# EAGLE design AntennaPCB (EAGLE 9.1.3)
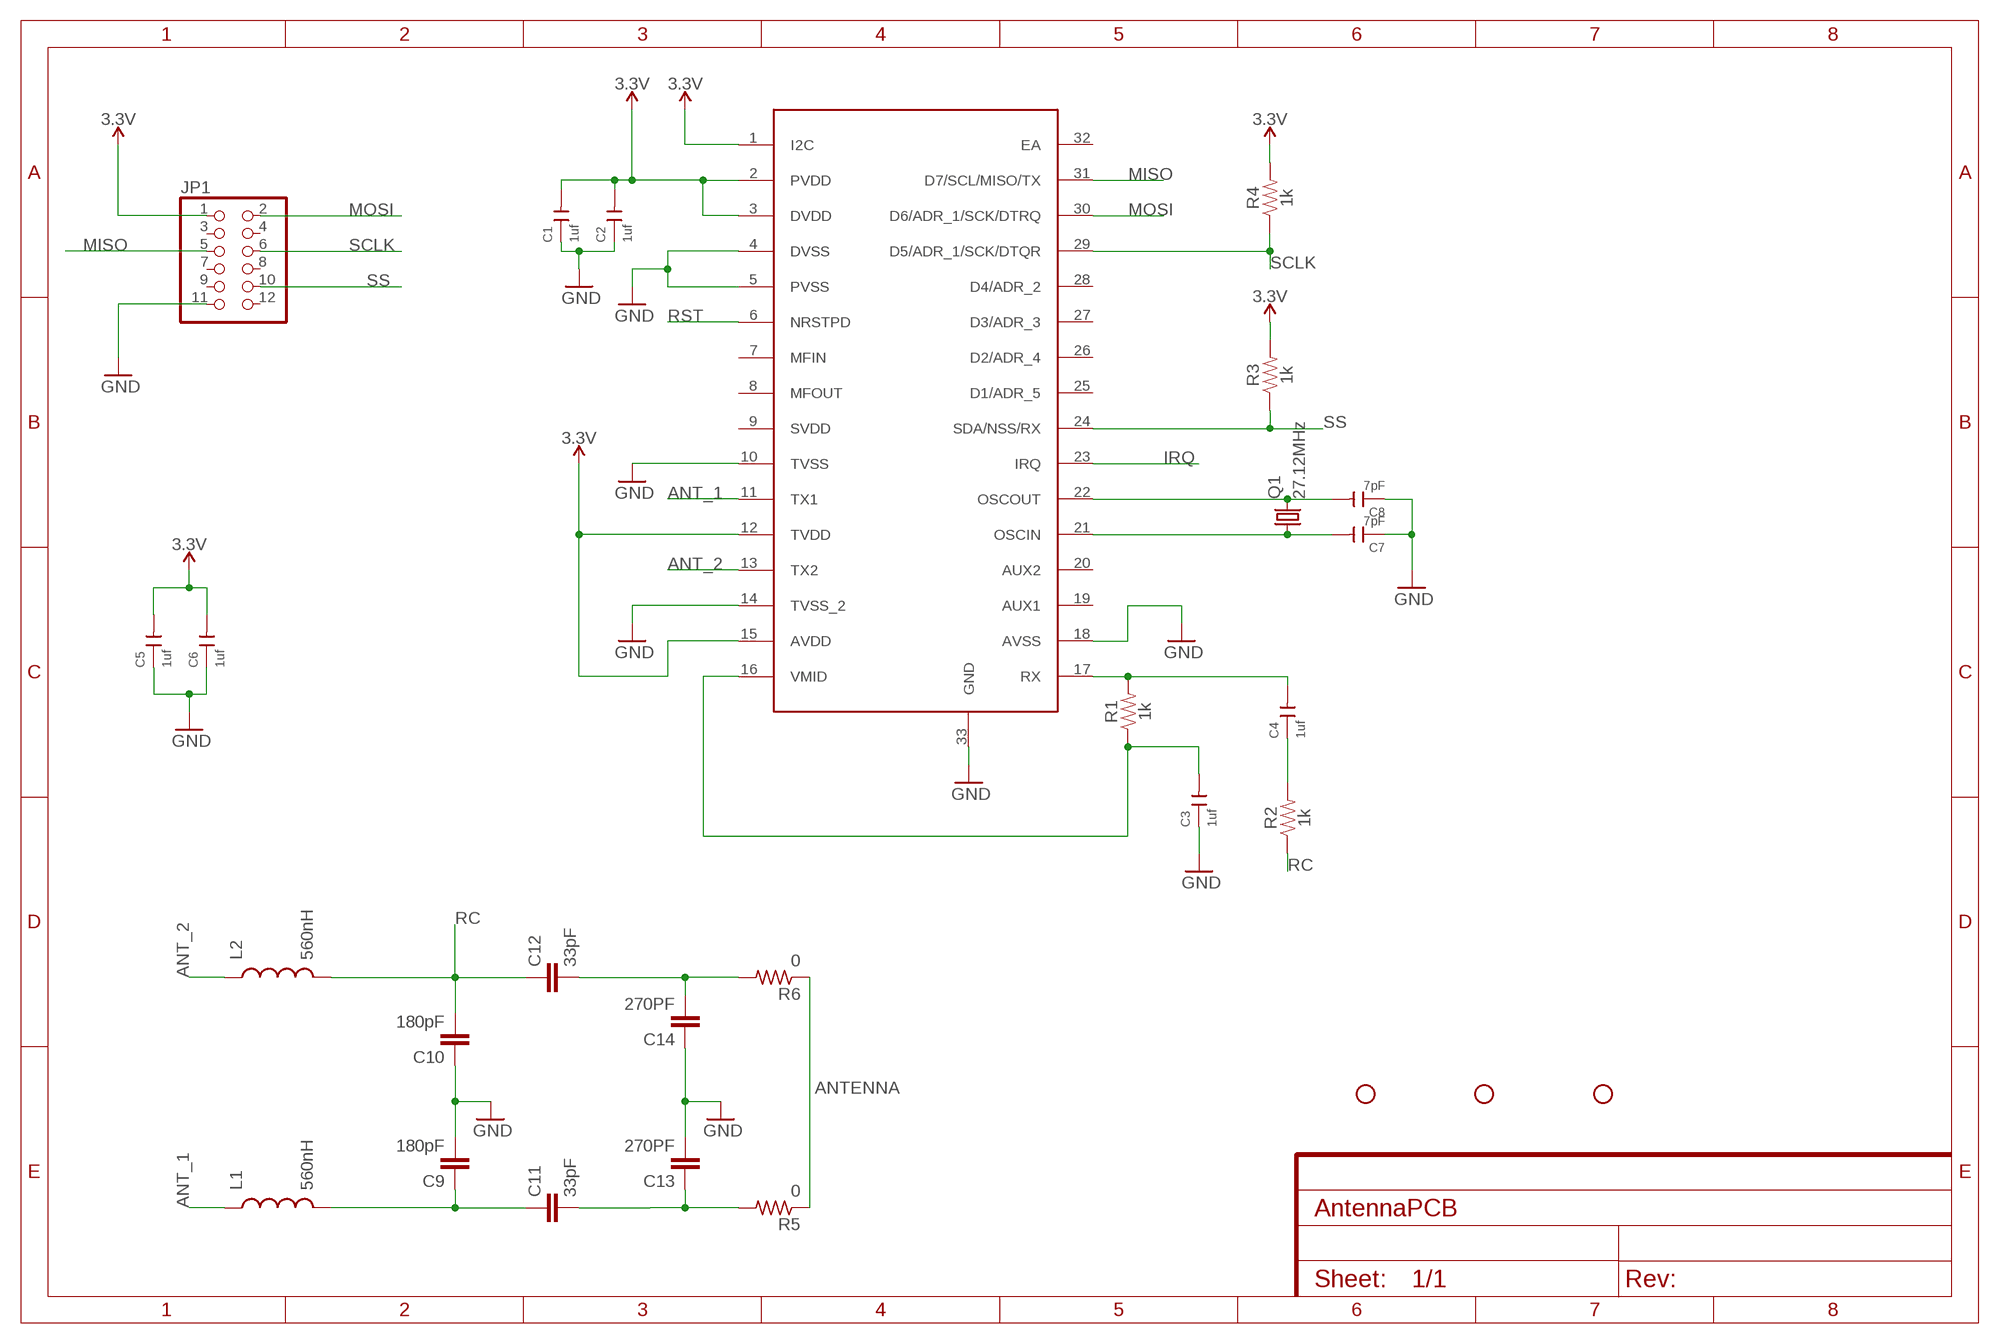
[diagram p0: schematic, sheet 1]
FRAME1 (FRAME-A4L): SPICEPREFIX: X

## Parts
C1  1uf  CERAMIC-1UF-25V-10%-X7R(0603)  [C0603]
C2  1uf  CERAMIC-1UF-25V-10%-X7R(0603)  [C0603]
C3  1uf  CERAMIC-1UF-25V-10%-X7R(0603)  [C0603]
C4  1uf  CERAMIC-1UF-25V-10%-X7R(0603)  [C0603]
C5  1uf  CERAMIC-1UF-25V-10%-X7R(0603)  [C0603]
C6  1uf  CERAMIC-1UF-25V-10%-X7R(0603)  [C0603]
C7  7pF  CERAMIC-1UF-25V-10%-X7R(0603)  [C0603]
C8  7pF  CERAMIC-1UF-25V-10%-X7R(0603)  [C0603]
C9  180pF  180PF-0603-50V-5%  [0603]
C10  180pF  180PF-0603-50V-5%  [0603]
C11  33pF  33PF-0603-50V-5%  [0603]
C12  33pF  33PF-0603-50V-5%  [0603]
C13  270PF  270PF-0603-50V-5%  [0603]
C14  270PF  270PF-0603-50V-5%  [0603]
H1  STAND-OFF  [STAND-OFF]
H2  STAND-OFF  [STAND-OFF]
H3  STAND-OFF  [STAND-OFF]
JP1  PINHD-2X6  [2X06]
L1  560nH  INDUCTOR  [L0603]
L2  560nH  INDUCTOR  [L0603]
Q1  27.12MHz  CRYSTALHC49S  [HC49/S]
R1  1k  1KOHM-0603-1/10W-1%  [0603]
R2  1k  1KOHM-0603-1/10W-1%  [0603]
R3  1k  1KOHM-0603-1/10W-1%  [0603]
R4  1k  1KOHM-0603-1/10W-1%  [0603]
R5  0  ERJ-8GEY0R00V  [RES_1206]
R6  0  ERJ-8GEY0R00V  [RES_1206]
U$1  MFRC522  [HVQFN32]

## Nets
3.3V: C1.2 C2.2 C5.2 C6.2 JP1.1 R3.2 R4.2 U$1.1(I2C) U$1.2(PVDD) U$1.3(DVDD) U$1.12(TVDD) U$1.15(AVDD)
ANT_1: L1.1 U$1.11(TX1)
ANT_2: L2.1 U$1.13(TX2)
ANTENNA: R5.1 R6.1
GND: C1.1 C2.1 C3.1 C5.1 C6.1 C7.1 C8.1 C9.2 C10.1 C13.2 C14.1 JP1.11 U$1.4(DVSS) U$1.5(PVSS) U$1.10(TVSS) U$1.14(TVSS_2) U$1.18(AVSS) U$1.33(GND)
IRQ: U$1.23(IRQ)
MISO: JP1.5 U$1.31(D7/SCL/MISO/TX)
MOSI: JP1.2 U$1.30(D6/ADR_1/SCK/DTRQ)
N$1: C3.2 R1.1 U$1.16(VMID)
N$2: C4.2 R1.2 U$1.17(RX)
N$3: C4.1 R2.2
N$5: C8.2 Q1.2 U$1.22(OSCOUT)
N$6: C7.2 Q1.1 U$1.21(OSCIN)
N$9: C9.1 C11.1 L1.2
N$10: C11.2 C13.1 R5.2
N$11: C12.2 C14.2 R6.2
RC: C10.2 C12.1 L2.2 R2.1
RST: U$1.6(NRSTPD)
SCLK: JP1.6 R4.1 U$1.29(D5/ADR_1/SCK/DTQR)
SS: JP1.10 R3.1 U$1.24(SDA/NSS/RX)
Unconnected: JP1.3 JP1.4 JP1.7 JP1.8 JP1.9 JP1.12 U$1.7(MFIN) U$1.8(MFOUT) U$1.9(SVDD) U$1.19(AUX1) U$1.20(AUX2) U$1.25(D1/ADR_5) U$1.26(D2/ADR_4) U$1.27(D3/ADR_3) U$1.28(D4/ADR_2) U$1.32(EA)

## Library data of the parts
C1-C6 = Seeed-Capacitor:CERAMIC-1UF-25V-10%-X7R(0603): 302010139; MPN: CC0603KRX7R8BB105
C7 C8 = Seeed-Capacitor:CERAMIC-1UF-25V-10%-X7R(0603): 302010139; MPN: CC0603KRX7R8BB105; VALUE: 1uf
C9 C10 = SparkFun-Capacitors:180PF: 180pF/0.18nF ceramic capacitors A capacitor is a passive two-terminal electrical component used to store electrical energy temporarily in an electric field.; PROD_ID: CAP-11661
C11 C12 = SparkFun-Capacitors:33PF: 33pF ceramic capacitors A capacitor is a passive two-terminal electrical component used to store electrical energy temporarily in an electric field.; PROD_ID: CAP-10142
C13 C14 = SparkFun-Capacitors:270PF: 270pF/0.27nF ceramic capacitors A capacitor is a passive two-terminal electrical component used to store electrical energy temporarily in an electric field.; PROD_ID: CAP-13339
H1-H3 = SparkFun-Hardware:STAND-OFF: Stand Off Drill holes for mechanically mounting via screws, standoffs, etc. Note: Use the keepout ring to avoid running the screw head into surrounding components. Variant Overviews STAND-OFF - Mechanical footprint for a #4 phillips button head screw. STAND-OFF-TIGHT - Mechanical footprint for a #4 phillips button head screw, Example SparkFun Products Screw - Phillips Head (1/4", 4-40, 10 pack) <https://www.sparkfun.com/products/10453> (PRT-10453) Screw - Phillips Head (1/2", 4-40, 10 pack) <https://www.sparkfun.com/products/10452> (PRT-10452) Screw - Phillips Head (3/4", 4-40, 10 pack) <https://www.sparkfun.com/products/10451> (PRT-10451) Screw - Phillips Head (1", 4-40, 10 pack) <https://www.sparkfun.com/products/10450> (PRT-10450)
JP1 = pinhead:PINHD-2X6: PIN HEADER
L1 L2 = BeagleBone_Blue_R3:INDUCTOR: Inductors Basic Inductor/Choke - 0603 and 1206. Footprints are not proven and vary greatly between part numbers. SRN6045- 33uH, 20% 1.4A
Q1 = crystal:CRYSTAL: CRYSTAL; OC_FARNELL: 1667008; OC_NEWARK: unknown
R1-R4 = SparkFun-Resistors:1KOHM: 1kΩ resistor A resistor is a passive two-terminal electrical component that implements electrical resistance as a circuit element. Resistors act to reduce current flow, and, at the same time, act to lower voltage levels within circuits. - Wikipedia; PROD_ID: RES-07856
R5 R6 = Resistor_Capacitor:ERJ-8GEY0R00V: RES SMD 0 OHM JUMPER 1/4W 1206 Manufacturer's datasheet <https://industrial.panasonic.com/ww/products/resistors/chip-resistors/general-purpose-chip-resistors/thick-film-chip-resistors/ERJ8GEY0R00V>; CREATED_BY: PCBLayout.com; DIGIKEY_PART_NUMBER: P0.0ETR-ND; MANUFACTURER: Panasonic Electronic Components; MPN: ERJ-8GEY0R00V; PACKAGE: SMD 1206
U$1 = SeniorDesignParts:MFRC522

## Board
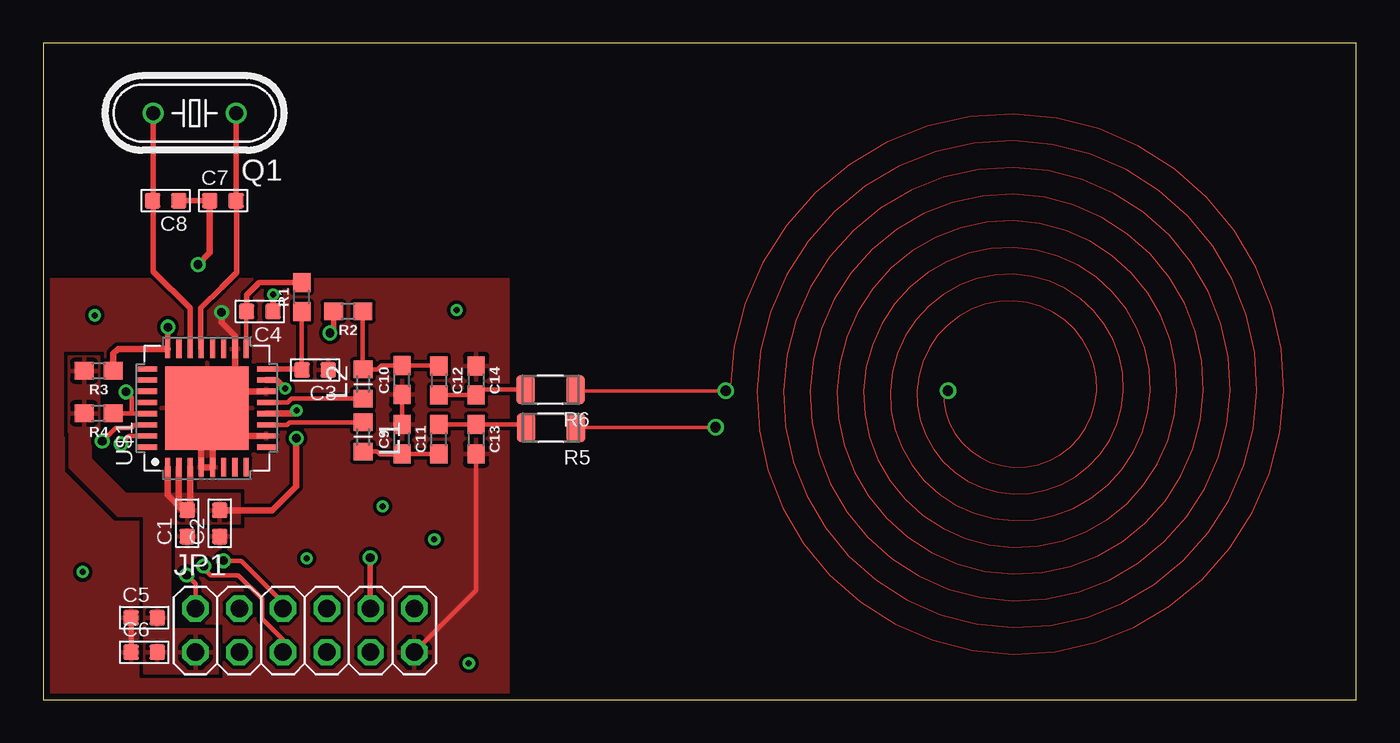
[diagram p1: board, top side]
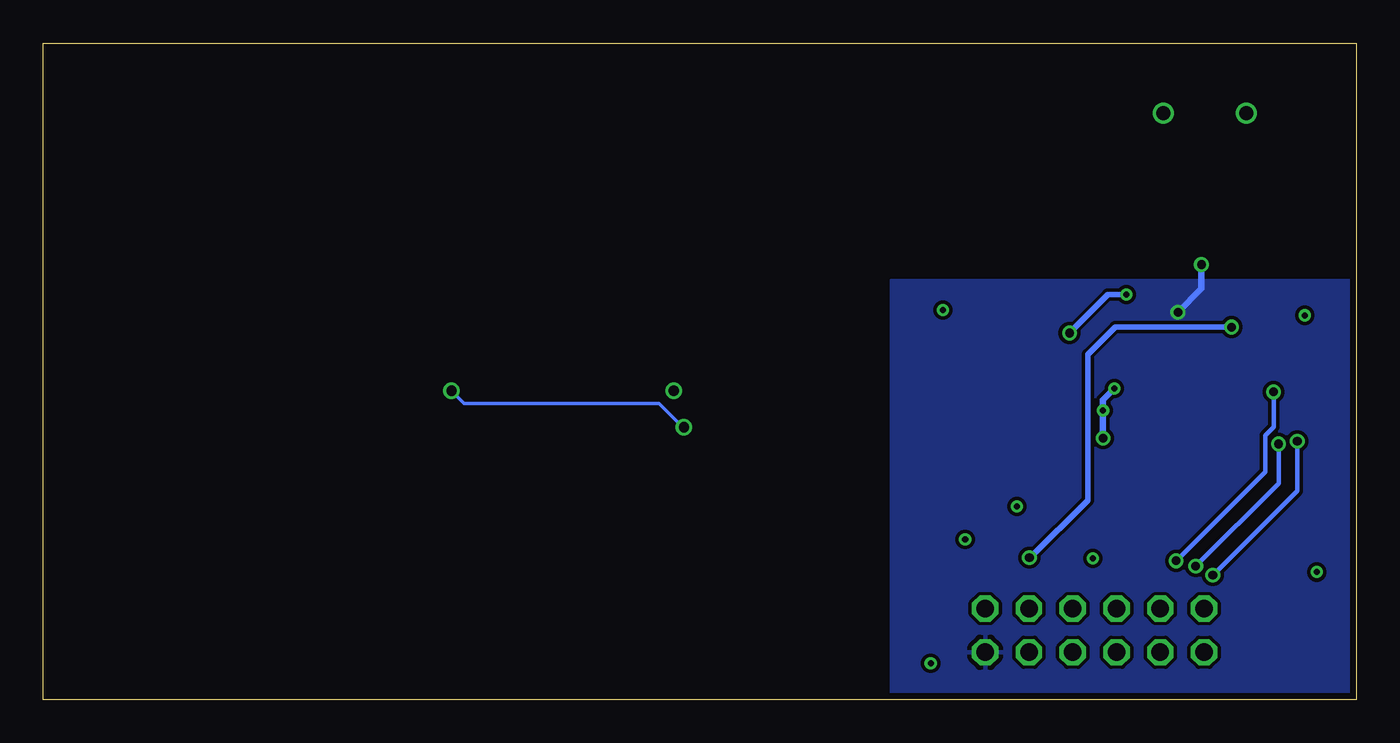
[diagram p2: board, bottom side, seen from below]

Size 76.2 x 38.1 mm. Coordinates in mm from the lower left corner, seen from the top.
Outline: 0,0 76.2,0 76.2,38.1 0,38.1 0,0
Copper layers (1*16): Top 0.0356mm / dielectric 1.5011mm / Bottom 0.0356mm
Design rules "ECE_Senior_Design": minimum track width 8mil, minimum drill 13mil, track to track 8mil, track to pad 8mil, pad to pad 6mil, via to via 8mil, smd to smd 6mil, copper to edge 15mil, drill to drill 8mil, minimum pad ring 7mil, minimum via ring 7mil, stop-mask expansion 3mil, vias tented up to drill 0mil, thermal gap 10mil

### Footprints (pad centres in the part's own frame; a part is rotated, then mirrored left to right if it is on the bottom)
C0603 = smd 0.889 x 0.889: 1 0,0.762; 2 0,-0.762
0603 = smd 1.1 x 1: 1 -0.85,0; 2 0.85,0
2X06 = drill 1.016 octagon: 1 -6.35,-1.27; 2 -6.35,1.27; 3 -3.81,-1.27; 4 -3.81,1.27; 5 -1.27,-1.27; 6 -1.27,1.27; 7 1.27,-1.27; 8 1.27,1.27; 9 3.81,-1.27; 10 3.81,1.27; 11 6.35,-1.27; 12 6.35,1.27
L0603 = smd 1 x 1.1: 1 -0.85,0; 2 0.85,0
HC49/S = drill 0.813: 1 -2.413,0; 2 2.413,0
RES_1206 = smd 1.08 x 1.68: 1 -1.445,0; 2 1.445,0
HVQFN32 = smd 1.075 x 0.3: 1 -0.263,5.45; 2 -0.263,4.8; 3 -0.263,4.15; 4 -0.263,3.5; 5 -0.263,2.85; 6 -0.263,2.2; 7 -0.263,1.55; 8 -0.263,0.9; 17 6.612,0.9; 18 6.612,1.55; 19 6.612,2.2; 20 6.612,2.85; 21 6.612,3.5; 22 6.612,4.15; 23 6.612,4.8; 24 6.612,5.45 | smd 0.3 x 1.075: 9 0.9,-0.263; 10 1.55,-0.263; 11 2.2,-0.263; 12 2.85,-0.263; 13 3.5,-0.263; 14 4.15,-0.263; 15 4.8,-0.263; 16 5.45,-0.263; 25 5.45,6.612; 26 4.8,6.612; 27 4.15,6.612; 28 3.5,6.612; 29 2.85,6.612; 30 2.2,6.612; 31 1.55,6.612; 32 0.9,6.612 | smd 4.85 x 4.85: 33 3.175,3.175

### Placement (x,y rotation side)
C1  8.37,10.23 180 top
C2  10.26,10.23 180 top
C3  15.78,19.13 270 top
C4  12.57,22.53 270 top
C5  5.87,4.75 90 top
C6  5.87,2.74 90 top
C7  10.44,28.96 90 top
C8  7.11,28.96 270 top
C9  20.83,15.11 90 top
C10  20.83,18.54 90 top
C11  22.96,15.11 90 top
C12  22.96,18.52 270 top
C13  25.12,15.11 270 top
C14  25.12,18.52 270 top
JP1  15.19,4.01 0 top
L1  18.57,15.24 270 top
L2  18.57,18.31 90 top
Q1  8.79,34.04 180 top
R1  15.01,23.36 90 top
R2  17.7,22.53 180 top
R3  3.23,19.08 180 top
R4  3.23,16.61 180 top
R5  29.46,15.77 180 top
R6  29.44,17.98 180 top
U$1  12.68,13.74 90 top

### Tracks (layer width: path | path; a pad name or v marks a point on that pad's centre or on a via)
3.3V  (via drill 0.35, 0.5)
  Top 0.381: U$1.1 7.23,11.87 8.11,10.99 C1.2 | U$1.2 7.88,11.48 C1.2 | U$1.3 8.53,11.15 C1.2 | C2.2 13.3,10.99 14.69,12.38 v14.69,15.16 v14.7,15.17 | v14.04,18.05 13.55,18.54 U$1.15 | U$1.12 14.08,16.59 14.1,16.61 14.54,16.61 v14.7,16.77
  Bottom 0.381: v14.7,15.17 v14.7,16.77 14.7,17.39 v14.04,18.05
  pour Top: 10.16,4.06 7.39,4.06 7.39,11.94 5.84,11.94 5.84,1.52 10.16,1.52
  pour Top: 7.11,10.92 7.11,10.21 11.43,10.21 11.43,11.94 11.18,11.94 7.11,11.94
  pour Top: 2.16,19.94 3.25,19.94 3.25,15.49 1.5,15.49 1.5,19.94
  pour Top: 1.52,17.27 1.52,13.46 4.32,10.67 7.62,10.67 7.62,11.94 4.83,11.94 2.79,13.97 2.79,17.27
ANT_1
  Top 0.254: U$1.11 14.16,15.94 14.31,16.09 L1.1
ANT_2
  Top 0.254: L2.1 14.41,17.46 14.19,17.24 U$1.13
ANTENNA  (via drill 0.6 pad 0.5)
  Top 0.01: v52.5,17.92 52.26,17.92 52.27,17.28 52.38,16.64 52.59,16.03 52.91,15.45 53.31,14.92 53.79,14.46 54.34,14.07 54.96,13.77 55.62,13.57 56.31,13.48 57.01,13.5 57.7,13.63 58.37,13.86 59.01,14.2 59.58,14.64 60.09,15.18 60.5,15.78 60.82,16.45 61.03,17.17 61.13,17.92 61.11,18.68 60.97,19.43 60.71,20.16 60.34,20.85 59.86,21.47 59.28,22.01 58.62,22.46 57.89,22.8 57.12,23.03 56.31,23.13 55.48,23.11 54.67,22.95 53.89,22.67 53.15,22.26 52.48,21.74 51.9,21.12 51.42,20.41 51.05,19.63 50.81,18.79 50.71,17.92 50.74,17.04 50.91,16.16 51.21,15.32 51.65,14.54 52.21,13.82 52.88,13.2 53.64,12.69 54.48,12.3 55.38,12.04 56.31,11.93 57.25,11.97 58.18,12.15 59.08,12.48 59.92,12.95 60.68,13.55 61.34,14.26 61.88,15.08 62.3,15.97 62.56,16.93 62.68,17.92 62.64,18.92 62.44,19.91 62.09,20.87 61.59,21.76 60.95,22.57 60.19,23.27 59.32,23.84 58.37,24.28 57.36,24.56 56.31,24.68 55.24,24.64 54.19,24.43 53.18,24.05 52.24,23.52 51.39,22.84 50.65,22.03 50.04,21.11 49.58,20.11 49.28,19.03 49.16,17.92 49.21,16.8 49.43,15.69 49.83,14.62 50.4,13.63 51.11,12.73 51.97,11.95 52.94,11.31 54,10.82 55.13,10.51 56.31,10.38 57.49,10.44 58.66,10.68 59.78,11.1 60.83,11.7 61.77,12.45 62.59,13.35 63.26,14.38 63.77,15.49 64.1,16.69 64.23,17.92 64.17,19.17 63.92,20.39 63.47,21.57 62.84,22.67 62.05,23.66 61.1,24.52 60.03,25.22 58.85,25.75 57.6,26.09 56.31,26.23 55,26.17 53.71,25.9 52.48,25.43 51.33,24.77 50.29,23.93 49.39,22.94 48.66,21.82 48.11,20.58 47.75,19.27 47.61,17.92 47.68,16.55 47.96,15.21 48.45,13.92 49.14,12.71 50.02,11.63 51.06,10.69 52.23,9.93 53.52,9.35 54.89,8.98 56.31,8.83 57.73,8.91 59.14,9.2 60.48,9.72 61.74,10.44 62.87,11.36 63.85,12.44 64.65,13.67 65.24,15.02 65.63,16.44 65.78,17.92 65.7,19.41 65.39,20.87 64.85,22.27 64.1,23.58 63.14,24.76 62.01,25.77 60.73,26.6 59.33,27.23 57.84,27.62 56.31,27.78 54.76,27.7 53.23,27.37 51.78,26.81 50.42,26.02 49.2,25.03 48.14,23.85 47.28,22.52 46.63,21.06 46.22,19.52 46.06,17.92 46.15,16.31 46.48,14.73 47.07,13.21 47.89,11.8 48.92,10.54 50.15,9.44 51.53,8.54 53.04,7.88 54.65,7.45 56.31,7.28 57.98,7.38 59.62,7.73 61.19,8.34 62.65,9.19 63.97,10.26 65.1,11.53 66.03,12.97 66.72,14.54 67.16,16.2 67.33,17.92 67.23,19.65 66.87,21.35 66.23,22.98 65.35,24.49 64.24,25.85 62.92,27.03 61.44,27.98 59.81,28.7 58.09,29.15 56.31,29.33 54.52,29.23 52.76,28.85 51.07,28.19 49.51,27.28 48.1,26.13 46.89,24.77 45.9,23.22 45.16,21.54 44.69,19.76 44.51,17.92 44.61,16.07 45.01,14.25 45.69,12.51 46.63,10.89 47.83,9.44 49.23,8.19 50.83,7.16 52.56,6.4 54.41,5.92 56.31,5.73 58.22,5.84 60.1,6.25 61.89,6.96 63.56,7.93 65.06,9.16 66.36,10.62 67.41,12.26 68.19,14.06 68.69,15.96 68.88,17.92 68.77,19.89 68.34,21.83 67.61,23.68 66.61,25.4 65.34,26.95 63.84,28.28 62.14,29.37 60.29,30.17 58.33,30.68 56.31,30.88 54.27,30.76 52.28,30.32 50.37,29.57 48.6,28.53 47,27.22 45.63,25.68 44.52,23.93 43.68,22.02 43.16,20 42.96,17.92 43.08,15.82 43.54,13.77 44.31,11.81 45.38,9.98 46.73,8.34 48.32,6.93 50.12,5.78 52.09,4.93 54.16,4.39 56.31,4.18 58.46,4.31 60.58,4.78 62.6,5.58 64.47,6.68 66.16,8.07 67.61,9.71 68.79,11.56 69.67,13.58 70.22,15.72 70.43,17.92 70.3,20.14 69.81,22.31 69,24.39 67.86,26.31 66.43,28.05 64.75,29.54 62.84,30.75 60.77,31.65 58.57,32.22 56.31,32.43 54.03,32.29 51.8,31.8 49.67,30.95 47.69,29.79 45.91,28.32 44.38,26.59 43.13,24.63 42.21,22.5 41.63,20.25 41.41,17.92 41.55,15.58 42.06,13.29 42.93,11.1 44.13,9.07 45.63,7.25 47.41,5.68 49.42,4.4 51.61,3.45 53.92,2.86 56.31,2.63 58.7,2.78 61.05,3.31 63.3,4.2 65.38,5.43 67.25,6.97 68.86,8.8 70.17,10.86 71.14,13.1 71.75,15.47 71.98,17.92 71.83,20.38 71.29,22.79 70.38,25.09 69.11,27.22 67.53,29.14 65.66,30.79 63.55,32.13 61.25,33.12 58.81,33.75 56.31,33.98 53.79,33.82 51.32,33.27 48.96,32.34 46.77,31.04 44.81,29.41 43.12,27.5 41.75,25.34 40.74,22.98 40.1,20.49 39.86,17.92 v39.61,17.92
  Top 0.203: R6.1 30.95,17.92 v39.61,17.92 | v39.01,15.8 30.93,15.8 R5.1
  Bottom 0.203: v39.01,15.8 39.06,15.8 40.45,17.18 51.77,17.18 v52.5,17.92
GND  (via drill 0.5)
  Top 0.254: C10.1 C9.2 | JP1.11 25.12,6.33 C13.2
  Top 0.305: C7.1 C8.1 | C5.1 C6.1
  Top 0.381: C7.1 9.68,25.93 v8.99,25.25 | v10.36,22.48 10.36,21.88 11.13,21.1 U$1.18 11.13,18.54 10.48,17.89 | 9.83,16.59 U$1.5 U$1.4 9.18,16.59 U$1.33 | 9.83,16.59 U$1.33 | U$1.10 11.13,15.29 9.83,16.59 | U$1.14 10.48,17.89 | 10.48,17.89 U$1.33
  Bottom 0.381: v8.99,25.25 8.99,23.84 v10.36,22.48
  pour Top (rank 2): 0,0 27,0 27,24.41 0,24.41
  pour Bottom (rank 2): 27.01,-0.05 -0.02,-0.05 -0.02,24.36 27.01,24.36
MISO  (via drill 0.5)
  Top 0.254: JP1.5 13.92,3.45 12.7,4.67 12.7,5.84 | v4.52,14.84 4.97,15.29 U$1.31 | 12.7,5.84 | 12.7,5.84 | 12.7,5.84 11.33,7.21 9.73,7.21 9.32,7.62 v9.32,7.75
  Bottom 0.254: v9.32,7.75 4.52,12.55 v4.52,14.84
MOSI  (via drill 0.5)
  Top 0.254: JP1.2 8.84,6.71 v8.33,7.21 | v3.43,14.99 4.22,15.77 5.11,15.77 5.27,15.94 U$1.30
  Bottom 0.254: v8.33,7.21 3.43,12.11 v3.43,14.99
N$1
  Top 0.254: R1.1 C3.2
  Top 0.305: U$1.16 14.96,19.19 C3.2
N$2
  Top 0.254: U$1.17 11.78,22.53 C4.2
  Top 0.305: C4.2 11.81,23.48 12.54,24.21 R1.2
N$3  (via drill 0.35, 0.5)
  Top 0.305: R2.2 16.85,21.48 v16.65,21.27 | v13.34,23.5 v13.34,23.49 C4.1
  Bottom 0.305: v16.65,21.27 14.42,23.5 v13.34,23.5
N$4  (via drill 0.35)
  other vias: 19.7,11.2
N$5
  Top 0.305: Q1.2 6.38,28.98 C8.2 6.4,28.91 6.4,24.84 8.53,22.71 U$1.22
N$6
  Top 0.305: Q1.1 C7.2 11.23,28.93 11.23,24.79 10.36,23.92 9.14,22.71 9.14,20.39 U$1.21
N$8  (via drill 0.35)
  other vias: 2.3,7.4
N$9
  Top 0.254: L1.2 19.39,14.39 19.56,14.22 20.79,14.22 C9.1 C11.1
N$10
  Top 0.254: C11.2 C13.1 27.83,15.96 R5.2
N$11
  Top 0.254: C12.2 C14.2 25.44,17.98 R6.2
N$12  (via drill 0.35)
  other vias: 3,22.3
N$13  (via drill 0.35)
  other vias: 15.3,8.2
N$14  (via drill 0.35)
  other vias: 24,22.6
N$15  (via drill 0.35)
  other vias: 22.7,9.3
N$16  (via drill 0.35)
  other vias: 24.7,2.1
RC
  Top 0.254: R2.1 18.55,19.18 L2.2 19.42,19.16 19.65,19.39 C10.2 22.94,19.39 C12.1
SCLK  (via drill 0.5)
  Top 0.254: 5.13,16.61 5.23,16.61 6.05,16.61 U$1.29 | JP1.6 13.92,5.61 11.48,8.05 v10.46,8.05 | v4.8,17.86 5.13,17.53 5.13,16.61 | R4.1 5.13,16.61
  Bottom 0.254: v4.8,17.86 4.8,15.83 5.3,15.34 5.3,13.21 v10.46,8.05
SS  (via drill 0.5)
  Top 0.305: U$1.24 7.23,21.61 v7.24,21.61 | v18.97,8.23 18.97,5.31 JP1.10
  Top 0.381: R3.1 4.08,20.08 4.35,20.35 U$1.24
  Bottom 0.305: v7.24,21.61 11,21.61 13.99,21.61 15.6,20.02 15.6,11.56 18.97,8.18 v18.97,8.23